# Altium project MyPCB.PrjPcb
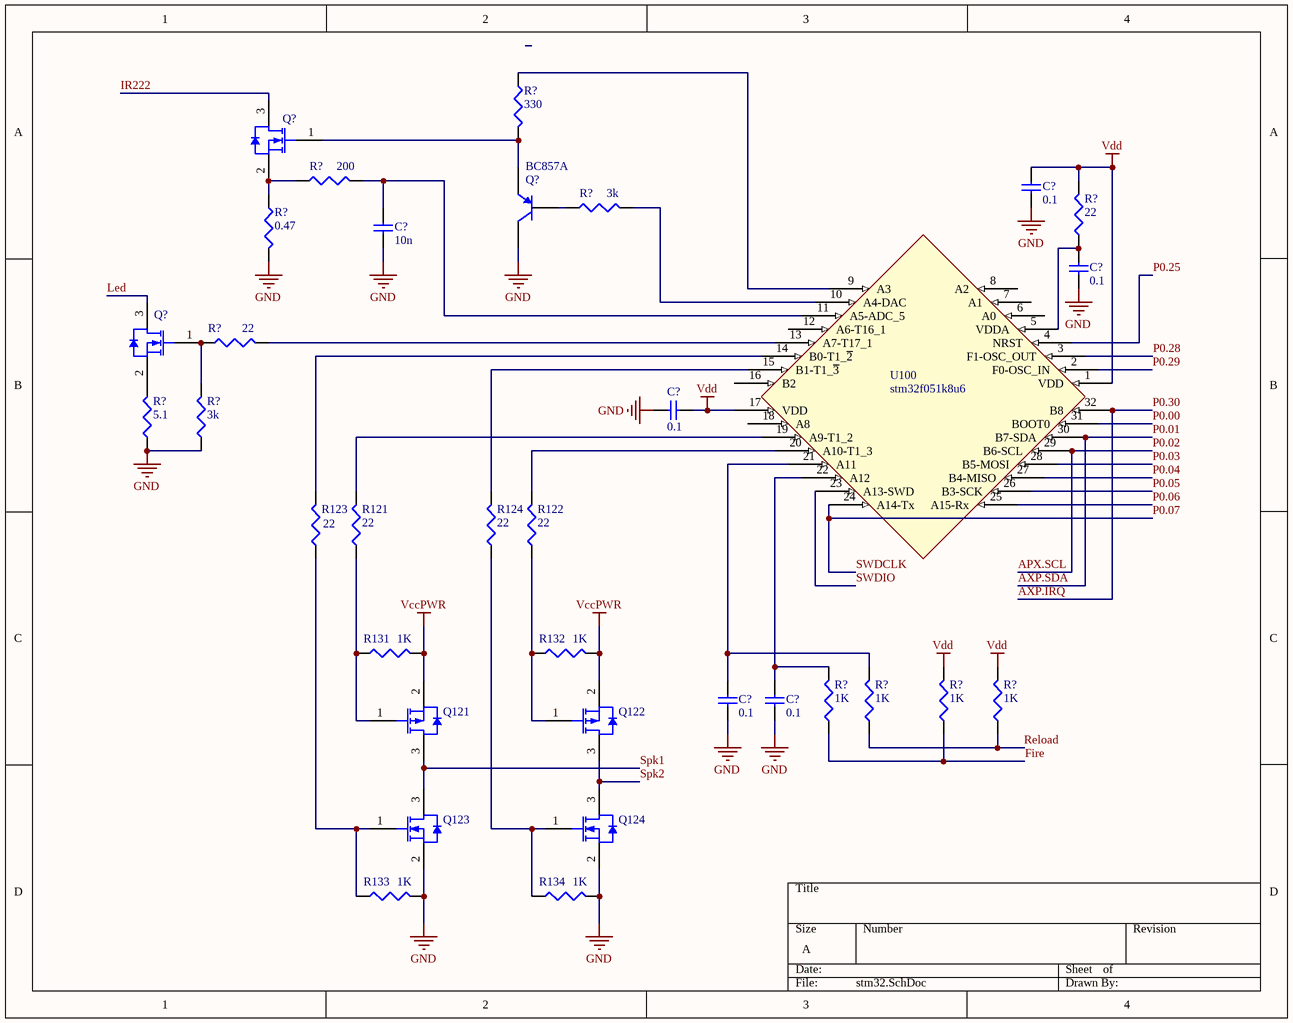
[diagram p0: stm32.SchDoc]
3 sheets, 73 parts. Net scope: global (net labels, ports and power ports of the same name join across sheets).
Board files: PCB1.PcbDoc, nrf51x22_qfax.PcbDoc
Sheets:
  stm32.SchDoc
  nrf51x22_qfaa.SchDoc
  AXP209.SchDoc

## Sheet stm32.SchDoc
size A

### Parts
(Parts that share a designator on the sheet are numbered #1, #2 ... from top to bottom, then left to right.)
C?#1  0.1  [CAPC1608X06L]
C?#2  10n  [CAPC1608X06L]
C?#3  0.1  [CAPC1608X06L]
C?#4  0.1  [CAPC1608X06L]
C?#5  0.1  [CAPC1608X06L]
C?#6  0.1  [CAPC1608X06L]
Q121  (no value)  [INF-PG-SOT23_N]
Q122  (no value)  [INF-PG-SOT23_N]
Q123  (no value)  [INF-PG-SOT23_N]
Q124  (no value)  [INF-PG-SOT23_N]
Q?#1  (no value)  [INF-PG-SOT23_N]
Q?#2  BC857A  [INF-SOT23_N]
Q?#3  (no value)  [INF-PG-SOT23_N]
R121  value 22  [J1-0603]
R122  value 22  [J1-0603]
R123  value 22  [J1-0603]
R124  value 22  [J1-0603]
R131  value 1K  [J1-0603]
R132  value 1K  [J1-0603]
R133  value 1K  [J1-0603]
R134  value 1K  [J1-0603]
R?#1  value 330  [J1-0603]
R?#2  value 200  [J1-0603]
R?#3  value 3k  [J1-0603]
R?#4  value 22  [J1-0603]
R?#5  value 0.47  [J1-0603]
R?#6  value 22  [J1-0603]
R?#7  value 5.1  [J1-0603]
R?#8  value 3k  [J1-0603]
R?#9  value 1K  [J1-0603]
R?#10  value 1K  [J1-0603]
R?#11  value 1K  [J1-0603]
R?#12  value 1K  [J1-0603]
U100  stm32f051k8u6  [stm32f051k8u6]

### Nets
GND: C?#1.1 C?#2.1 C?#3.1 C?#4.2 C?#5.1 C?#6.1 Q123.2(SOURCE) Q124.2(SOURCE) Q?#2.3(C) R133.2 R134.2 R?#5.1 R?#7.1 R?#8.1
VccPWR: Q121.2(SOURCE) Q122.2(SOURCE) R131.2 R132.2
Vdd: C?#1.2 C?#4.1 R?#4.2 R?#11.2 R?#12.2 U100.1(VDD) U100.17(VDD)
APX.SCL: U100.29(B6-SCL)  [also labelled P0.02]
AXP.IRQ: U100.32(B8)  [also labelled P0.30]
AXP.SDA: U100.30(B7-SDA)  [also labelled P0.01]
Fire: R?#9.1 R?#11.1
IR222: Q?#1.3(DRAIN)
Led: Q?#3.3(DRAIN)
P0.00: U100.31(BOOT0)
P0.03: U100.28(B5-MOSI)
P0.04: U100.27(B4-MISO)
P0.05: U100.26(B3-SCK)
P0.06: U100.25(A15-Rx)
P0.07: U100.24(A14-Tx)  [also labelled SWDCLK]
P0.25: U100.4(NRST)
P0.28: U100.3(F1-OSC_OUT)
P0.29: U100.2(F0-OSC_IN)
Reload: R?#10.1 R?#12.1
Spk1: Q121.3(DRAIN) Q123.3(DRAIN)
Spk2: Q122.3(DRAIN) Q124.3(DRAIN)
SWDIO: U100.23(A13-SWD)
NetC?#2_2: C?#2.2 R?#2.1 U100.11(A5-ADC_5)
NetC?#3_2: C?#3.2 R?#4.1 U100.5(VDDA)
NetC?#5_2: C?#5.2 R?#10.2 U100.21(A11)
NetC?#6_2: C?#6.2 R?#9.2 U100.22(A12)
NetQ121_1: Q121.1(GATE) R121.1 R131.1
NetQ122_1: Q122.1(GATE) R122.1 R132.1
NetQ123_1: Q123.1(GATE) R123.1 R133.1
NetQ124_1: Q124.1(GATE) R124.1 R134.1
NetQ?#1_1: Q?#1.1(GATE) Q?#2.2(E) R?#1.1
NetQ?#1_2: Q?#1.2(SOURCE) R?#2.2 R?#5.2
NetQ?#2_1: Q?#2.1(B) R?#3.2
NetQ?#3_1: Q?#3.1(GATE) R?#6.1 R?#8.2
NetQ?#3_2: Q?#3.2(SOURCE) R?#7.2
NetR121_2: R121.2 U100.19(A9-T1_2)
NetR122_2: R122.2 U100.20(A10-T1_3)
NetR123_2: R123.2 U100.14(B0-T1_~{2})
NetR124_2: R124.2 U100.15(B1-T1_~{3})
NetR?#1_2: R?#1.2 U100.9(A3)
NetR?#3_1: R?#3.1 U100.10(A4-DAC)
NetR?#6_2: R?#6.2 U100.13(A7-T17_1)

Not connected (* = marked no-connect by the designer): U100 6(A0) 7(A1) 8(A2) 12(A6-T16_1) 16(B2) 18(A8)

### Library data of the parts
C?#1 C?#3-C?#6 = CAP_0603: Capacitor, X5R, ±10%; Part Number: C0603-4µ7; Note: 6.3V; Artikkelnr Noca: 20069060; Artikkelnr Simpro: N.A.; Manufacturer: *; Manufacturer Part Number: *; Datasheet: *; LatestRevisionDate: 2009-11-23; Pin Count: 2; Publisher: Nordic Semiconductor; Published: 2009-05-08; Value: 0.1; Supplier: *; Supplier part number: *; 2nd source Supplier: *; 2nd source part number: *; Footprint Doc: 0603
C?#2 = CAP_0603: Capacitor, X5R, ±10%; Part Number: C0603-4µ7; Value: 0.1; Note: 6.3V; Artikkelnr Noca: 20069060; Artikkelnr Simpro: N.A.; Manufacturer: *; Manufacturer Part Number: *; Datasheet: *; LatestRevisionDate: 2009-11-23; Pin Count: 2; Publisher: Nordic Semiconductor; Published: 2009-05-08; Supplier: *; Supplier part number: *; 2nd source Supplier: *; 2nd source part number: *; Footprint Doc: 0603
Q121 Q122 = BSS215P H6327: P-Channel OptiMOS P2 Small-Signal-Transistor, -20 V VDS, -1.5 A ID, -55 to 150 degC, PG-SOT23, Reel, Green; Manufacturer: Infineon; Green: TRUE; ID (max): -1.5 A; IDpuls (max): -6 A; Pto t (max): 0.5 W; QG: -3.6 nC; RDS (on) (max): 280 mOhm; RDS (on) (max) (@4.5V): 150 mOhm; Rth: 250 K/W; VDS (max): -20 V; VGS(th) (max): -0.6 V; VGS(th) (min): -1.2 V; DatasheetVersion: Rev. 2.3; PackageVersion: Apr-08; PackageReference: PG-SOT23; PackageDescription: 3-Pin Small Outline Transistor Package, 2.9 x 1.3 mm Body, 0.95 mm Pitch; Supplier 1: Digi-Key; Supplier Part Number 1: BSS215P H6327TR-ND; Supplier 2: Digi-Key; Supplier Part Number 2: BSS215P H6327CT-ND; Supplier 3: Digi-Key; Supplier Part Number 3: BSS215P H6327DKR-ND; Halogen-free: TRUE; Packing: Reel; RDS (on) (max) (@2.5V): 280 mOhm; Mounting Technology: Surface Mount; PartNumber: BSS215P H6327; ComponentLink1Description: Manufacturer URL; ComponentLink1URL: http://www.infineon.com/; ComponentLink2Description: Datasheet; ComponentLink2URL: http://www.infineon.com/dgdl/BSS215P_Rev2.3.pdf?folderId=db3a304314dca38901154a72e3951a65&fileId=db3a304330f6860601311833f57144fb; ComponentLink3Description: Package Specification; ComponentLink3URL: http://www.infineon.com/dgdl/SOT23-Package_Overview.pdf?folderId=db3a30431936bc4b0119532290053c66&fileId=db3a30431936bc4b0119533468123c85
Q123 Q124 Q?#1 Q?#3 = BSS806N: N-Channel OptiMOS 2 Small-Signal-Transistor, 20 V VDS, 2.3 A ID, -55 to 150 degC, PG-SOT23, Reel, Green; Manufacturer: Infineon; Green: TRUE; ID (max): 2.3 A; IDpuls (max): 9.3 A; Ptot (max): 0.5 W; QG: 1.7 nC; RDS (on) (max): 57 mOhm; RDS (on) (max) (@1.8V): 82 mOhm; RthJA (max): 250 K/W; VDS (max): 20 V; VGS(th) (max): 0.75 V; VGS(th) (min): 0.3 V; DatasheetVersion: Rev. 2.3; PackageVersion: Apr-08; PackageReference: PG-SOT23; PackageDescription: 3-Pin Small Outline Transistor Package, 2.9 x 1.3 mm Body, 0.95 mm Pitch; Halogen-free: TRUE; Packing: Reel; RDS (on) (max) (@2.5V): 57 mOhm; Mounting Technology: Surface Mount; PartNumber: BSS806N; ComponentLink1Description: Manufacturer URL; ComponentLink1URL: http://www.infineon.com/; ComponentLink2Description: Datasheet; ComponentLink2URL: http://www.infineon.com/dgdl/BSS806N_Rev2.3_.pdf?folderId=db3a3043156fd573011622e10b5c1f67&fileId=db3a304330f686060131185f0553451c; ComponentLink3Description: Package Specification; ComponentLink3URL: http://www.infineon.com/dgdl/SOT23-Package_Overview.pdf?folderId=db3a30431936bc4b0119532290053c66&fileId=db3a30431936bc4b0119533468123c85
Q?#2 = BC857A: PNP Silicon AF Transistor, 45 V VCEO, 100 mA IC, SOT23, Reel, Green; Manufacturer: Infineon; fT (typ): 250 MHz; Green: TRUE; IBM (max): 200 mA; IC (max): 100 mA; ICBO (max): 15 nA; Ptot (max): 330 mW; VCBO (max): 50 V; VCEO (max): 45 V; VEBO (max): 5 V; PackageVersion: Apr-08; PackageReference: SOT23; PackageDescription: 3-Pin Small Outline Transistor Package, 1.3 x 2.9 mm Body, 0.95 mm Pitch; ICM (max): 200 mA; Packing: Reel; Polarity: PNP; Mounting Technology: Surface Mount; PartNumber: BC857A; ComponentLink1Description: Manufacturer URL; ComponentLink1URL: http://www.infineon.com/; ComponentLink2Description: Datasheet; ComponentLink2URL: http://www.infineon.com/dgdl/bc857series_bc858series_bc859series_bc860series.pdf?folderId=db3a304314dca389011541d30fa21656&fileId=db3a304314dca389011541da0e3a1661; ComponentLink3Description: Package Specification; ComponentLink3URL: http://www.infineon.com/dgdl/SOT23-Package_Overview.pdf?folderId=db3a30431936bc4b0119532290053c66&fileId=db3a30431936bc4b0119533468123c85
R121-R124 R131-R134 R?#1-R?#12 = Res3: Resistor; Published: 8-Jun-2000; LatestRevisionDate: 29-May-2009; LatestRevisionNote: IPC-7351 Footprint Added.; PackageReference: J1-0603; Publisher: Altium Limited; PackageDescription: Chip Resistor

## Sheet nrf51x22_qfaa.SchDoc: nRF51x22-QFAA Reference Layout
size A4; Revision: 2.5; SheetNumber: 1; SheetTotal: 1; DrawnBy: RUBR; DocumentSize: A4; PCAName: nRF51x22-QFAA Reference Layout
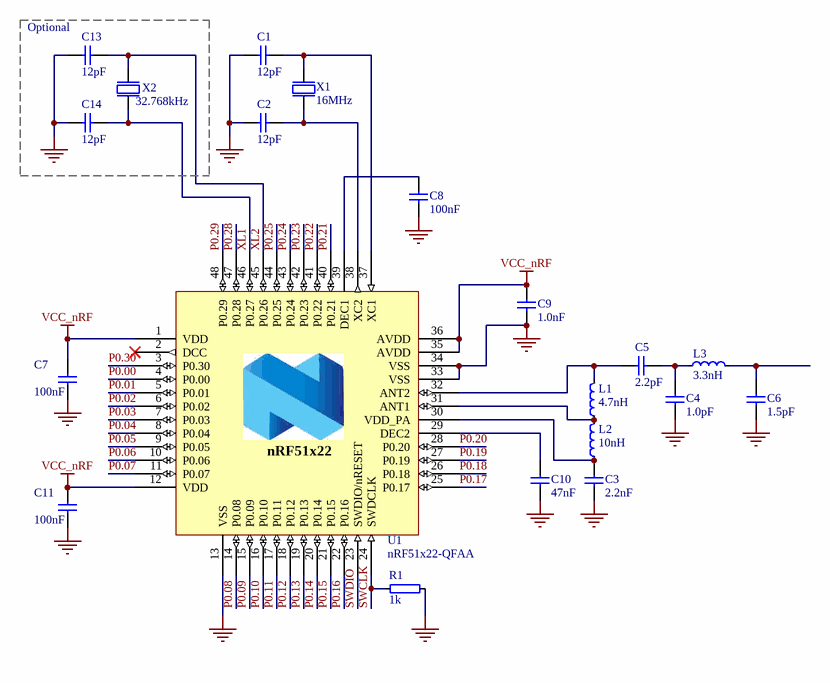
[diagram p1: nrf51x22_qfaa.SchDoc]

### Parts
C1  12pF  [CAPC1005X04L]
C2  12pF  [CAPC1005X04L]
C3  2.2nF  [CAPC1005X04L]
C4  1.0pF  [CAPC1005X04L]
C5  2.2pF  [CAPC1005X04L]
C6  1.5pF  [CAPC1005X04L]
C7  100nF  [CAPC1005X04L]
C8  100nF  [CAPC1005X04L]
C9  1.0nF  [CAPC1005X04L]
C10  47nF  [CAPC1005X04L]
C11  100nF  [CAPC1005X04L]
C13  12pF  [CAPC1005X04L]
C14  12pF  [CAPC1005X04L]
L1  4.7nH  [INDC1005X04L]
L2  10nH  [INDC1005X04L]
L3  3.3nH  [INDC1005X04L]
R1  1k  [RESC1005X04L]
U1  nRF51x22-QFAA  [QFN40P600X600X90-48N]
X1  16MHz  [BT-XTAL_2520]
X2  32.768kHz  [XTAL_3215]

### Blocks framed on the sheet
Optional: C13 C14 X2

### Nets
GND: C1.2 C2.2 C3.2 C4.2 C6.2 C7.2 C8.2 C9.2 C10.2 C11.2 C13.1 C14.1 R1.1 U1.13(VSS) U1.33(VSS) U1.34(VSS) U1.49 X1.2(GND) X1.4(GND)
VCC_nRF: C7.1 C9.1 C11.1 U1.1(VDD) U1.12(VDD) U1.35(AVDD) U1.36(AVDD)
P0.00: U1.4(P0.00)
P0.01: U1.5(P0.01)  [project net AXP.SDA]
P0.02: U1.6(P0.02)  [project net APX.SCL]
P0.03: U1.7(P0.03)
P0.04: U1.8(P0.04)
P0.05: U1.9(P0.05)
P0.06: U1.10(P0.06)
P0.07: U1.11(P0.07)
P0.08: U1.14(P0.08)
P0.09: U1.15(P0.09)
P0.10: U1.16(P0.10)
P0.11: U1.17(P0.11)
P0.12: U1.18(P0.12)
P0.13: U1.19(P0.13)
P0.14: U1.20(P0.14)
P0.15: U1.21(P0.15)
P0.16: U1.22(P0.16)
P0.17: U1.25(P0.17)
P0.18: U1.26(P0.18)
P0.19: U1.27(P0.19)
P0.20: U1.28(P0.20)
P0.21: U1.40(P0.21)
P0.22: U1.41(P0.22)
P0.23: U1.42(P0.23)
P0.24: U1.43(P0.24)
P0.25: U1.44(P0.25)
P0.28: U1.47(P0.28)
P0.29: U1.48(P0.29)
P0.30: U1.3(P0.30)  [project net AXP.IRQ]
SWCLK: R1.2 U1.24(SWDCLK)
SWDIO: U1.23(SWDIO/nRESET)
XL1: C14.2 U1.46(P0.27) X2.2(out)
XL2: C13.2 U1.45(P0.26) X2.1(inp)
NetC1_1: C1.1 U1.37(XC1) X1.1(inp)
NetC2_1: C2.1 U1.38(XC2) X1.3(out)
NetC3_1: C3.1 L2.1 U1.30(VDD_PA)
NetC4_1: C4.1 C5.2 L3.1
NetC5_1: C5.1 L1.2 U1.32(ANT2)
NetC6_1: C6.1 L3.2
NetC8_1: C8.1 U1.39(DEC1)
NetC10_1: C10.1 U1.29(DEC2)
NetL1_1: L1.1 L2.2 U1.31(ANT1)

Not connected (* = marked no-connect by the designer): U1 2(DCC)*

### Notes on the sheet
- Title
- Size
- Date:
- Project Number
- Sheet         of
- Revision
- File:
- Drawn By:
- (in symbol nRF51x22-QFAA) nRF51x22

### Library data of the parts
C1 C2 C13 C14 = C0402-12p: Capacitor, NP0, ±2%; Note: 50V; Artikkelnr Noca: 20029159; Artikkelnr Simpro: N.A.; Part Number: C0402-12p; Manufacturer: *; Manufacturer Part Number: *; Datasheet: *; LatestRevisionDate: 2011-05-11; Pin Count: 2; Publisher: Nordic Semiconductor; Published: 2009-05-08; Value: 12pF; Supplier: *; Supplier part number: *; 2nd source Supplier: *; 2nd source part number: *; Footprint Doc: 0402
C3 = C0402-2n2: Capacitor, X7R, ±10%; Note: 50V; Artikkelnr Noca: 20039221; Artikkelnr Simpro: N.A.; Part Number: C0402-2n2; Manufacturer: *; Manufacturer Part Number: *; Datasheet: *; LatestRevisionDate: 2009-11-23; Pin Count: 2; Publisher: Nordic Semiconductor; Published: 2009-05-08; Value: 2.2nF; Supplier: *; Supplier part number: *; 2nd source Supplier: *; 2nd source part number: *; Footprint Doc: 0402
C4 = C0402-1.0p: Capacitor, NP0, ±0.1pF; Note: 50V; Artikkelnr Noca: 20029140; Artikkelnr Simpro: N.A.; Part Number: C0402-1.0p; Manufacturer: *; Manufacturer Part Number: *; Datasheet: *; LatestRevisionDate: 2009-11-23; Pin Count: 2; Publisher: Nordic Semiconductor; Published: 2009-05-08; Value: 1.0pF; Supplier: *; Supplier part number: *; 2nd source Supplier: *; 2nd source part number: *; Footprint Doc: 0402
C5 = C0402-2.2p: Capacitor, NP0, ±0.1pF; Note: 50V; Artikkelnr Noca: 20029145; Artikkelnr Simpro: N.A.; Part Number: C0402-2.2p; Manufacturer: *; Manufacturer Part Number: *; Datasheet: *; LatestRevisionDate: 2009-05-08; Pin Count: 2; Publisher: Nordic Semiconductor; Published: 2009-05-08; Value: 2.2pF; Supplier: *; Supplier part number: *; 2nd source Supplier: *; 2nd source part number: *; Footprint Doc: 0402
C6 = C0402-1.5p: Capacitor, NP0, ±0.1pF; Note: 50V; Artikkelnr Noca: 20029139; Artikkelnr Simpro: N.A.; Part Number: C0402-1.5p; Manufacturer: *; Manufacturer Part Number: *; Datasheet: *; LatestRevisionDate: 2009-11-23; Pin Count: 2; Publisher: Nordic Semiconductor; Published: 2009-05-08; Value: 1.5pF; Supplier: *; Supplier part number: *; 2nd source Supplier: *; 2nd source part number: *; Footprint Doc: 0402
C7 C8 C11 = C0402-100n: Capacitor, X7R, ±10%; Note: 16V; Artikkelnr Noca: 20039200; Artikkelnr Simpro: N.A.; Part Number: C0402-100n; Manufacturer: *; Manufacturer Part Number: *; Datasheet: *; LatestRevisionDate: 2009-11-23; Pin Count: 2; Publisher: Nordic Semiconductor; Published: 2009-05-08; Value: 100nF; Supplier: *; Supplier part number: *; 2nd source Supplier: *; 2nd source part number: *; Footprint Doc: 0402
C9 = C0402-1n0: Capacitor, X7R, ±10%; Note: 50V; Artikkelnr Noca: 20039223; Artikkelnr Simpro: N.A.; Part Number: C0402-1n0; Manufacturer: *; Manufacturer Part Number: *; Datasheet: *; LatestRevisionDate: 2009-11-23; Pin Count: 2; Publisher: Nordic Semiconductor; Published: 2009-05-08; Value: 1.0nF; Supplier: *; Supplier part number: *; 2nd source Supplier: *; 2nd source part number: *; Footprint Doc: 0402
C10 = C0402-47n: Capacitor, X7R, ±10%; Note: Chip Cap 10%; Artikkelnr Noca: 20039389; Artikkelnr Simpro: N.A.; Part Number: C0402-47n; Manufacturer: *; Manufacturer Part Number: *; Datasheet: *; LatestRevisionDate: 2009-05-08; Pin Count: 2; Publisher: Nordic Semiconductor; Published: 2009-05-08; Value: 47nF; Supplier: *; Supplier part number: *; 2nd source Supplier: *; 2nd source part number: *; Footprint Doc: 0402
L1 = L0402-4n7: High frequency chip inductor ±5%; Manufacturer: Murata; Manufacturer Part Number: LQP15MN4N7B02D; Artikkelnr Noca: 33029164; Artikkelnr Simpro: N.A.; Part Number: L0402-4n7; Datasheet: http://search.murata.co.jp/Ceramy/image/img/PDF/ENG/L0075S0084LQP15M.pdf; LatestRevisionDate: 2012-09-19; Pin Count: 2; Publisher: Nordic Semiconductor; Published: 2009-05-08; Value: 4.7nH; Note: High frequency chip inductor ±5%; Supplier: Digi-Key; Supplier part number: 490-1132-1-ND; 2nd source Supplier: *; 2nd source part number: *; Footprint Doc: 0402
L2 = L0402-10n: High frequency chip inductor ±5%; Manufacturer: Murata; Manufacturer Part Number: LQP15MN10NG02D; Artikkelnr Noca: 33029425; Artikkelnr Simpro: N.A.; Part Number: L0402-10n; Datasheet: http://search.murata.co.jp/Ceramy/image/img/PDF/ENG/L0075S0084LQP15M.pdf; LatestRevisionDate: 2012-09-19; Pin Count: 2; Publisher: Nordic Semiconductor; Published: 2010-07-12; Value: 10nH; Note: High frequency chip inductor ±5%; Supplier: Mouser; Supplier part number: 81-LQP15MN10NG02D; 2nd source Supplier: *; 2nd source part number: *; Footprint Doc: 0402
L3 = L0402-3n3: High frequency chip inductor ±5%; Manufacturer: Murata; Manufacturer Part Number: LQP15MN3N3B02D; Artikkelnr Noca: 33029369; Artikkelnr Simpro: N.A.; Part Number: L0402-3n3; Datasheet: http://search.murata.co.jp/Ceramy/image/img/PDF/ENG/L0075S0084LQP15M.pdf; LatestRevisionDate: 2012-09-19; Pin Count: 2; Publisher: Nordic Semiconductor; Published: 2009-05-08; Value: 3.3nH; Note: High frequency chip inductor ±5%; Supplier: Digi-Key; Supplier part number: 490-1130-1-ND; 2nd source Supplier: *; 2nd source part number: *; Footprint Doc: 0402
R1 = R0402-1k0: Resistor, ±1%, 0.063W; Note: Chip Res 1%; Artikkelnr Noca: 27049073; Artikkelnr Simpro: N.A.; Value Ohm: 1000; Part Number: R0402-1k0; Manufacturer: *; Manufacturer Part Number: *; Datasheet: *; Footprint Doc: 0402; LatestRevisionDate: 2009-11-23; Pin Count: 2; Publisher: Nordic Semiconductor; Published: 2009-05-08; Value: 1k; Supplier: Farnell; Supplier part number: 173-8850; 2nd source Supplier: *; 2nd source part number: *
U1 = nRF51x22-QFAA: Multi-protocol Bluetooth Low Energy, ANT and 2.4GHz proprietary system-on-chip; Manufacturer: Nordic Semiconductor; Note: nRF51422 - QFN48 6x6 0.4mm pitch; Artikkelnr Noca: N.A.; Part Number: nRF51x22-QFAA; Manufacturer Part Number: nRF51x22-QFAA; Datasheet: *; LatestRevisionDate: 2014-09-24; Pin Count: 48; Publisher: Nordic Semiconductor; Published: 2014-09-24; Value: nRF51x22-QFAA; Supplier: Nordic Semiconductor; Supplier part number: *; 2nd source Supplier: *; 2nd source part number: *; Footprint Doc: QFN-48; Artikkelnr Simpro: N.A.
X1 = XTAL_SMD2520_16MHz_8pF_NDK: XTAL SMD 2520, 16MHz, Cl=8pF, Total Tol: ±40ppm; Manufacturer: NDK; Manufacturer Part Number: NX2520SA/16MHz/EXS00A-CS06713; Note: XTAL SMD 16.000MHz; Artikkelnr Noca: 22019192; Artikkelnr Simpro: N.A.; Part Number: XTAL_SMD2520_16MHz_8pF_NDK; Datasheet: http://www.ndk.com/images/products/catalog/c_NX2520SA-STD-CSW-5_e.pdf; LatestRevisionDate: 2014-11-27; Pin Count: 4; Publisher: Nordic Semiconductor; Published: 2012-06-15; Value: 16MHz; Supplier: Digi-Key; Supplier part number: 644-1169-1-ND; 2nd source Supplier: *; 2nd source part number: *; Footprint Doc: XTAL_2520
X2 = XTAL_FC-135 32.768k: XTAL SMD 3215, 32.768kHz, Cl=9pF, Total Tol: ±50ppm; Manufacturer: Epson Toyocom; Manufacturer Part Number: FC-135 32.768KHZ ±20PPM,9.0PF; 2nd source part number: 127-8037; Note: XTAL SMD 32.768kHz, 3215; Artikkelnr Noca: 22019091; Artikkelnr Simpro: N.A.; Part Number: XTAL_FC-135 32.768k; Datasheet: http://www.farnell.com/datasheets/57480.pdf; LatestRevisionDate: 2014-03-27; Pin Count: 2; Publisher: Nordic Semiconductor; Published: 2010-10-18; Value: 32.768kHz; Supplier: Digi-Key; Supplier part number: FC-135 32.7680KA-AC-ND; 2nd source Supplier: Farnell; Footprint Doc: XTAL_3215

## Sheet AXP209.SchDoc
size A
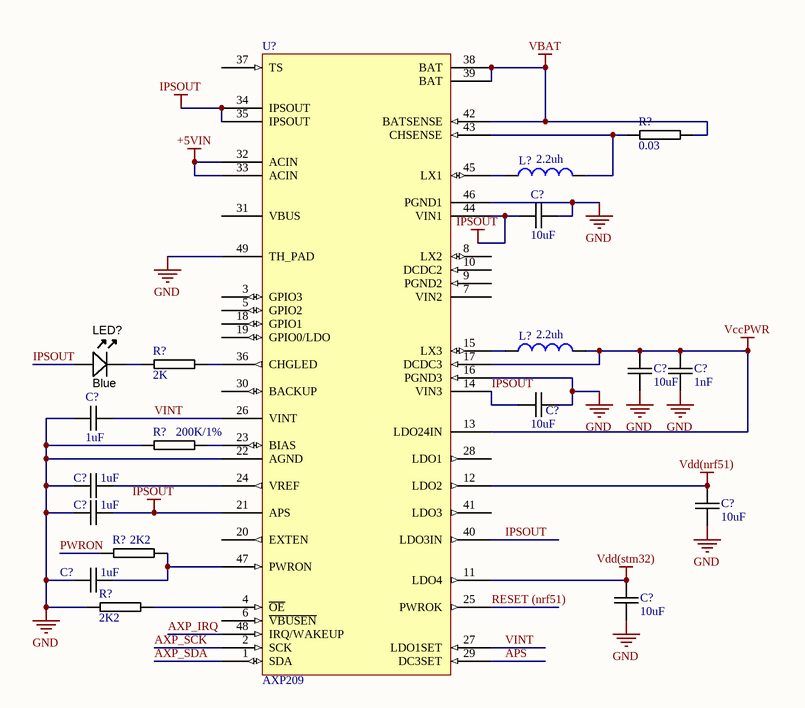
[diagram p2: AXP209.SchDoc]

### Parts
(Parts that share a designator on the sheet are numbered #1, #2 ... from top to bottom, then left to right.)
C?#7  10uF  [0603C-GENERIC]
C?#8  10uF  [0603C-GENERIC]
C?#9  1nF  [0603C-GENERIC]
C?#10  10uF  [0603C-GENERIC]
C?#11  1uF  [0603C-GENERIC]
C?#12  1uF  [0603C-GENERIC]
C?#13  10uF  [0603C-GENERIC]
C?#14  1uF  [0603C-GENERIC]
C?#15  1uF  [0603C-GENERIC]
C?#16  10uF  [0603C-GENERIC]
L?#1  2.2uh  [TAIYO_NRS4018T2R2MDGJ]
L?#2  2.2uh  [TAIYO_NRS4018T2R2MDGJ]
LED?  Blue  [LED-0805-K]
R?#13  0.03  [2512R-GENERIC]
R?#14  2K  [0603R-220K]
R?#15  200K/1%  [0603R-220K]
R?#16  2K2  [0603R-2K2]
R?#17  2K2  [0603R-2K2]
U?  AXP209  [QFN48]

### Nets
+5VIN: U?.32(ACIN) U?.33(ACIN)
GND: C?#7.2 C?#8.2 C?#9.2 C?#10.2 C?#11.1 C?#12.1 C?#13.2 C?#14.1 C?#15.1 C?#16.1 R?#15.1 R?#17.1 U?.16(PGND3) U?.22(AGND) U?.46(PGND1) U?.49(TH_PAD)
IPSOUT: C?#7.1 C?#10.1 C?#14.2 LED?.A U?.14(VIN3) U?.21(APS) U?.34(IPSOUT) U?.35(IPSOUT) U?.40(LDO3IN) U?.44(VIN1)
VBAT: R?#13.2 U?.38(BAT) U?.39(BAT) U?.42(BATSENSE)
VccPWR: C?#8.1 C?#9.1 L?#2.2 U?.13(LDO24IN) U?.17(DCDC3)
Vdd(nrf51): C?#13.1 U?.12(LDO2)
Vdd(stm32): C?#16.2 U?.11(LDO4)
APS: U?.29(DC3SET)
AXP_IRQ: U?.48(IRQ/WAKEUP)
AXP_SCK: U?.2(SCK)
AXP_SDA: U?.1(SDA)
PWRON: R?#16.1
RESET (nrf51): U?.25(PWROK)
VINT: C?#11.2 U?.26(VINT) U?.27(LDO1SET)
NetC?#12_2: C?#12.2 U?.24(VREF)
NetC?#15_2: C?#15.2 R?#16.2 U?.47(PWRON)
NetL?#1_1: L?#1.1 U?.45(LX1)
NetL?#1_2: L?#1.2 R?#13.1 U?.43(CHSENSE)
NetL?#2_1: L?#2.1 U?.15(LX3)
NetLED?_K: LED?.K R?#14.1
NetR?#14_2: R?#14.2 U?.36(CHGLED)
NetR?#15_2: R?#15.2 U?.23(BIAS)
NetR?#17_2: R?#17.2 U?.4(~{OE})

Not connected (* = marked no-connect by the designer): U? 3(GPIO3) 5(GPIO2) 6(~{VBUSEN}) 7(VIN2) 8(LX2) 9(PGND2) 10(DCDC2) 18(GPIO1) 19(GPIO0/LDO) 20(EXTEN) 28(LDO1) 30(BACKUP) 31(VBUS) 37(TS) 41(LDO3)

### Library data of the parts
C?#7 C?#8 C?#10 C?#13 C?#16 = 0603C-10UF-6V3-X5R-MUR: CAPACITOR 0603 CERAMIC; Manufacturer: Murata Electronics North America; Manufacturer Part Number: GRM188R60J106ME47D; Reel: C24; Supplier 1: Digi-Key; Supplier Part Number 1: 490-3896-2-ND
C?#9 = 0603C-1NF-50V-X7R-KEM: CAPACITOR 0603 CERAMIC; Reel: C45; Supplier 1: Digi-Key; Supplier Part Number 1: 399-1082-2-ND
C?#11 C?#12 C?#14 C?#15 = 0603C-1UF-25V-X5R-SAM: CAPACITOR 0603 CERAMIC; Reel: C17
L?#1 L?#2 = inductor_smd
LED? = LED_SMD_Blue_0805_100mcd: LED 0805 SMD Blue 100mcd 470nm; Manufacturer 1: Ligitek; Manufacturer Part Number 1: LG-170DBKZ-CT; Material: InGaN/GaN; Ratings: 100 mcd; 470 nm; Package / Case: 0805; Value: Blue; Color: Blue
R?#13 = 2512R-7R5: GENERIC RESISTOR 2512; Manufacturer Part Number: CRCW25127R50JNEG; Manufacturer: Vishay/Dale; REEL: R20; Supplier 1: Digi-Key; Supplier Part Number 1: 541-7.5XDKR-ND
R?#14 R?#15 = 0603R-220K: GENERIC RESISTOR 0603; Manufacturer: Stackpole Electronics Inc; Manufacturer Part Number: RMCF 1/16 220K 1% R; Resistance In Ohms: 220K; Power (Watts): 0.1W, 1/10W; Temperature Coefficient: ±100ppm/°C; Tolerance: ±1%; Supplier 1: Digi-Key; Supplier Part Number 1: RMCF1/16220KFR-ND; RoHS: RoHS Compliant; Composition: Thick Film; Lead Style: Surface Mount (SMD - SMT); Supplier: Digi-Key; Supplier Part Number: RMCF1/16220KFR-ND; Packaging: Tape & Reel (TR); Category: Resistors; Case: 0603 (1608 metric)
R?#16 R?#17 = 0603R-2K2: GENERIC RESISTOR 0603; Manufacturer Part Number: RMC 1/16 2.2K 1% R; Manufacturer: Stackpole Electronics Inc; REEL: R88; Supplier 1: Digi-Key; Supplier Part Number 1: RMCF0603FT2K20TR-ND

## Nets that join several sheets
GND: stm32 (14 pins), nrf51x22_qfaa (19 pins), AXP209 (16 pins)
VccPWR: stm32 (Q121.2 Q122.2 R131.2 R132.2), AXP209 (5 pins)
APX.SCL: stm32 (U100.29), nrf51x22_qfaa (U1.6)
AXP.IRQ: stm32 (U100.32), nrf51x22_qfaa (U1.3)
AXP.SDA: stm32 (U100.30), nrf51x22_qfaa (U1.5)
P0.00: stm32 (U100.31), nrf51x22_qfaa (U1.4)
P0.03: stm32 (U100.28), nrf51x22_qfaa (U1.7)
P0.04: stm32 (U100.27), nrf51x22_qfaa (U1.8)
P0.05: stm32 (U100.26), nrf51x22_qfaa (U1.9)
P0.06: stm32 (U100.25), nrf51x22_qfaa (U1.10)
P0.07: stm32 (U100.24), nrf51x22_qfaa (U1.11)
P0.25: stm32 (U100.4), nrf51x22_qfaa (U1.44)
P0.28: stm32 (U100.3), nrf51x22_qfaa (U1.47)
P0.29: stm32 (U100.2), nrf51x22_qfaa (U1.48)
SWDIO: stm32 (U100.23), nrf51x22_qfaa (U1.23)